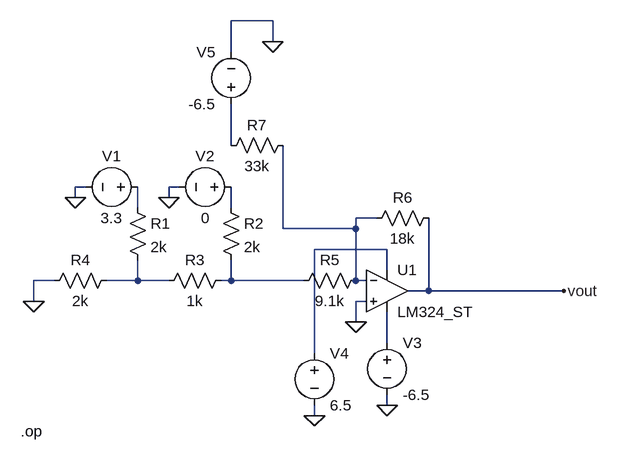
[diagram p0: schematic Wave_Select.asc]
Wave_Select.asc, the LTspice schematic file:
Version 4
SHEET 1 880 680
WIRE 304 -224 240 -224
WIRE 304 -192 304 -224
WIRE 240 -176 240 -224
WIRE 240 -32 240 -96
WIRE 16 32 0 32
WIRE 160 32 144 32
WIRE 0 48 0 32
WIRE 144 48 144 32
WIRE 96 64 96 32
WIRE 240 64 240 32
WIRE 464 80 432 80
WIRE 320 96 320 -32
WIRE 432 96 432 80
WIRE 432 96 320 96
WIRE 480 128 368 128
WIRE 480 160 480 128
WIRE -32 176 -64 176
WIRE 96 176 96 144
WIRE 96 176 48 176
WIRE 144 176 96 176
WIRE 240 176 240 144
WIRE 240 176 224 176
WIRE 352 176 240 176
WIRE 432 176 432 96
WIRE 448 176 432 176
WIRE 544 192 544 80
WIRE 544 192 512 192
WIRE 752 192 544 192
WIRE -64 208 -64 176
WIRE 448 208 432 208
WIRE 432 240 432 208
WIRE 480 272 480 224
WIRE 368 288 368 128
WIRE 480 368 480 352
WIRE 368 384 368 368
FLAG -64 208 0
FLAG 144 48 0
FLAG 0 48 0
FLAG 480 368 0
FLAG 368 384 0
FLAG 432 240 0
FLAG 304 -192 0
FLAG 752 192 vout
DATAFLAG 736 192 ""
SYMBOL res 80 48 R0
SYMATTR InstName R1
SYMATTR Value 2k
SYMBOL res 224 48 R0
SYMATTR InstName R2
SYMATTR Value 2k
SYMBOL res 240 160 R90
WINDOW 0 0 56 VBottom 2
WINDOW 3 32 56 VTop 2
SYMATTR InstName R3
SYMATTR Value 1k
SYMBOL res 64 160 R90
WINDOW 0 0 56 VBottom 2
WINDOW 3 32 56 VTop 2
SYMATTR InstName R4
SYMATTR Value 2k
SYMBOL voltage 112 32 R90
WINDOW 0 -32 56 VBottom 2
WINDOW 3 32 56 VTop 2
WINDOW 123 0 0 Left 0
WINDOW 39 0 0 Left 0
SYMATTR InstName V1
SYMATTR Value 3.3
SYMBOL voltage 256 32 R90
WINDOW 0 -32 56 VBottom 2
WINDOW 3 32 56 VTop 2
WINDOW 123 0 0 Left 0
WINDOW 39 0 0 Left 0
SYMATTR InstName V2
SYMATTR Value 0
SYMBOL ZZZ\\OpAmp\\LM324_ST 480 192 R0
SYMATTR InstName U1
SYMBOL res 448 160 R90
WINDOW 0 0 56 VBottom 2
WINDOW 3 32 56 VTop 2
SYMATTR InstName R5
SYMATTR Value 9.1k
SYMBOL res 560 64 R90
WINDOW 0 0 56 VBottom 2
WINDOW 3 32 56 VTop 2
SYMATTR InstName R6
SYMATTR Value 18k
SYMBOL voltage 480 256 R0
WINDOW 123 0 0 Left 0
WINDOW 39 0 0 Left 0
SYMATTR InstName V3
SYMATTR Value -6.5
SYMBOL voltage 368 272 R0
WINDOW 123 0 0 Left 0
WINDOW 39 0 0 Left 0
SYMATTR InstName V4
SYMATTR Value 6.5
SYMBOL res 336 -48 R90
WINDOW 0 0 56 VBottom 2
WINDOW 3 32 56 VTop 2
SYMATTR InstName R7
SYMATTR Value 33k
SYMBOL voltage 240 -80 R180
WINDOW 0 24 96 Left 2
WINDOW 3 24 16 Left 2
WINDOW 123 0 0 Left 0
WINDOW 39 0 0 Left 0
SYMATTR InstName V5
SYMATTR Value -6.5
TEXT -84 408 Left 2 !.op

The netlist it stands for:
* Wave_Select.asc
R1 N002 N006 2k
R2 N003 N007 2k
R3 N007 N006 1k
R4 N006 0 2k
V1 N002 0 3.3
V2 N003 0 0
* U1: LM324_ST (symbol ZZZ\OpAmp\LM324_ST not available, pins judged from their places): In+=0 In-=N004 V+=N005 V-=N008 OUT=vout
R5 N004 N007 9.1k
R6 vout N004 18k
V3 N008 0 -6.5
V4 N005 0 6.5
R7 N004 N001 33k
V5 N001 0 -6.5
.op
.backanno
.end